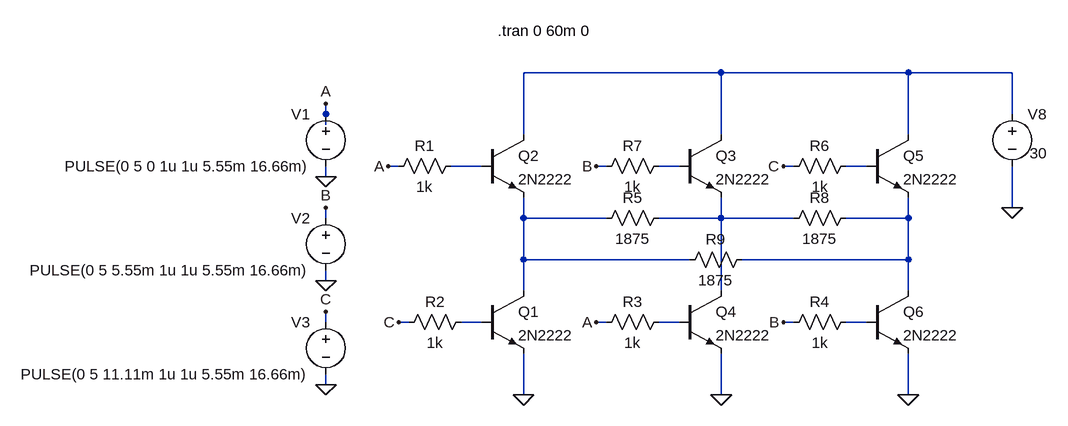
[diagram p0: schematic ponte h.asc]
ponte h.asc, the LTspice schematic file:
Version 4
SHEET 1 2516 1556
WIRE 1120 368 816 368
WIRE 1408 368 1120 368
WIRE 1568 368 1408 368
WIRE 512 432 512 416
WIRE 1568 432 1568 368
WIRE 512 448 512 432
WIRE 816 464 816 368
WIRE 1120 464 1120 368
WIRE 1408 464 1408 368
WIRE 624 512 608 512
WIRE 752 512 704 512
WIRE 944 512 928 512
WIRE 1056 512 1024 512
WIRE 1232 512 1216 512
WIRE 1344 512 1312 512
WIRE 512 528 512 512
WIRE 1568 576 1568 512
WIRE 512 592 512 576
WIRE 816 592 816 560
WIRE 944 592 816 592
WIRE 1120 592 1120 560
WIRE 1120 592 1024 592
WIRE 1232 592 1120 592
WIRE 1408 592 1408 560
WIRE 1408 592 1312 592
WIRE 816 656 816 592
WIRE 1072 656 816 656
WIRE 1408 656 1408 592
WIRE 1408 656 1152 656
WIRE 512 688 512 672
WIRE 816 704 816 656
WIRE 1120 704 1120 592
WIRE 1408 704 1408 656
WIRE 512 752 512 736
WIRE 640 752 624 752
WIRE 752 752 720 752
WIRE 944 752 928 752
WIRE 1056 752 1024 752
WIRE 1232 752 1216 752
WIRE 1344 752 1312 752
WIRE 512 848 512 832
WIRE 816 864 816 800
WIRE 1120 864 1120 800
WIRE 1408 864 1408 800
FLAG 816 864 0
FLAG 1568 576 0
FLAG 1120 864 0
FLAG 512 528 0
FLAG 512 688 0
FLAG 512 416 A
FLAG 512 576 B
FLAG 608 512 A
FLAG 928 752 A
FLAG 624 752 C
FLAG 928 512 B
FLAG 512 848 0
FLAG 512 736 C
FLAG 1408 864 0
FLAG 1216 752 B
FLAG 1216 512 C
SYMBOL voltage 1568 416 R0
WINDOW 3 27 76 Left 2
WINDOW 123 0 0 Left 2
WINDOW 39 0 0 Left 2
SYMATTR Value 30
SYMATTR InstName V8
SYMBOL npn 752 464 R0
SYMATTR InstName Q2
SYMATTR Value 2N2222
SYMBOL npn 752 704 R0
SYMATTR InstName Q1
SYMATTR Value 2N2222
SYMBOL npn 1056 464 R0
SYMATTR InstName Q3
SYMATTR Value 2N2222
SYMBOL npn 1056 704 R0
SYMATTR InstName Q4
SYMATTR Value 2N2222
SYMBOL res 720 496 R90
WINDOW 0 0 56 VBottom 2
WINDOW 3 32 56 VTop 2
SYMATTR InstName R1
SYMATTR Value 1k
SYMBOL voltage 512 416 M0
WINDOW 123 0 0 Left 2
WINDOW 39 0 0 Left 2
SYMATTR InstName V1
SYMATTR Value PULSE(0 5 0 1u 1u 5.55m 16.66m)
SYMBOL res 1040 576 R90
WINDOW 0 0 56 VBottom 2
WINDOW 3 32 56 VTop 2
SYMATTR InstName R5
SYMATTR Value 1875
SYMATTR SpiceLine tol=1 pwr=1
SYMBOL voltage 512 576 M0
WINDOW 123 0 0 Left 2
WINDOW 39 0 0 Left 2
SYMATTR InstName V2
SYMATTR Value PULSE(0 5 5.55m 1u 1u 5.55m 16.66m)
SYMBOL voltage 512 736 M0
WINDOW 123 0 0 Left 2
WINDOW 39 0 0 Left 2
SYMATTR InstName V3
SYMATTR Value PULSE(0 5 11.11m 1u 1u 5.55m 16.66m)
SYMBOL npn 1344 464 R0
SYMATTR InstName Q5
SYMATTR Value 2N2222
SYMBOL npn 1344 704 R0
SYMATTR InstName Q6
SYMATTR Value 2N2222
SYMBOL res 1328 576 R90
WINDOW 0 0 56 VBottom 2
WINDOW 3 32 56 VTop 2
SYMATTR InstName R8
SYMATTR Value 1875
SYMATTR SpiceLine tol=1 pwr=1
SYMBOL res 1168 640 R90
WINDOW 0 0 56 VBottom 2
WINDOW 3 32 56 VTop 2
SYMATTR InstName R9
SYMATTR Value 1875
SYMATTR SpiceLine tol=1 pwr=1
SYMBOL res 736 736 R90
WINDOW 0 0 56 VBottom 2
WINDOW 3 32 56 VTop 2
SYMATTR InstName R2
SYMATTR Value 1k
SYMBOL res 1040 736 R90
WINDOW 0 0 56 VBottom 2
WINDOW 3 32 56 VTop 2
SYMATTR InstName R3
SYMATTR Value 1k
SYMBOL res 1328 736 R90
WINDOW 0 0 56 VBottom 2
WINDOW 3 32 56 VTop 2
SYMATTR InstName R4
SYMATTR Value 1k
SYMBOL res 1328 496 R90
WINDOW 0 0 56 VBottom 2
WINDOW 3 32 56 VTop 2
SYMATTR InstName R6
SYMATTR Value 1k
SYMBOL res 1040 496 R90
WINDOW 0 0 56 VBottom 2
WINDOW 3 32 56 VTop 2
SYMATTR InstName R7
SYMATTR Value 1k
TEXT 776 304 Left 2 !.tran 0 60m 0

The netlist it stands for:
* ponte h.asc
V8 N001 0 30
Q2 N001 N002 N005 0 2N2222
Q1 N005 N008 0 0 2N2222
Q3 N001 N003 N006 0 2N2222
Q4 N006 N009 0 0 2N2222
R1 N002 A 1k
V1 A 0 PULSE(0 5 0 1u 1u 5.55m 16.66m)
R5 N006 N005 1875 tol=1 pwr=1
V2 B 0 PULSE(0 5 5.55m 1u 1u 5.55m 16.66m)
V3 C 0 PULSE(0 5 11.11m 1u 1u 5.55m 16.66m)
Q5 N001 N004 N007 0 2N2222
Q6 N007 N010 0 0 2N2222
R8 N007 N006 1875 tol=1 pwr=1
R9 N007 N005 1875 tol=1 pwr=1
R2 N008 C 1k
R3 N009 A 1k
R4 N010 B 1k
R6 N004 C 1k
R7 N003 B 1k
.model NPN NPN
.model PNP PNP
.lib standard.bjt
.tran 0 60m 0
.backanno
.end

* Results of the author's LTspice run, read from the files saved beside the schematic
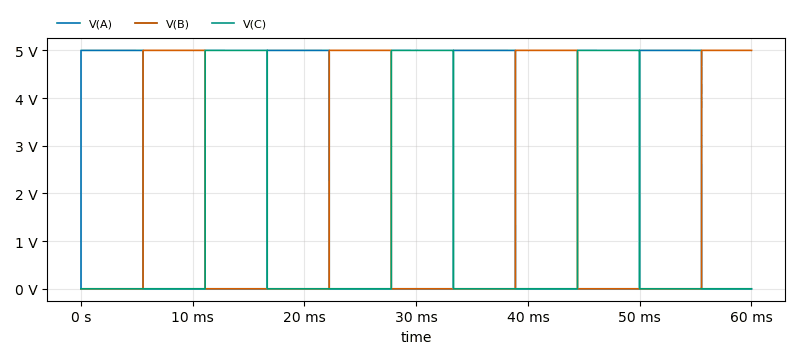
[diagram p1: Transient Analysis of ponte h.asc, plotted from the saved traces]
* Transient Analysis, 1 run:
*   V(A): min 0 V, max 5 V, average 1.85 V, rms 3.042 V, last 0 V
*   V(B): min 0 V, max 5 V, average 1.76 V, rms 2.967 V, last 5 V
*   V(C): min 0 V, max 5 V, average 1.388 V, rms 2.634 V, last 0 V